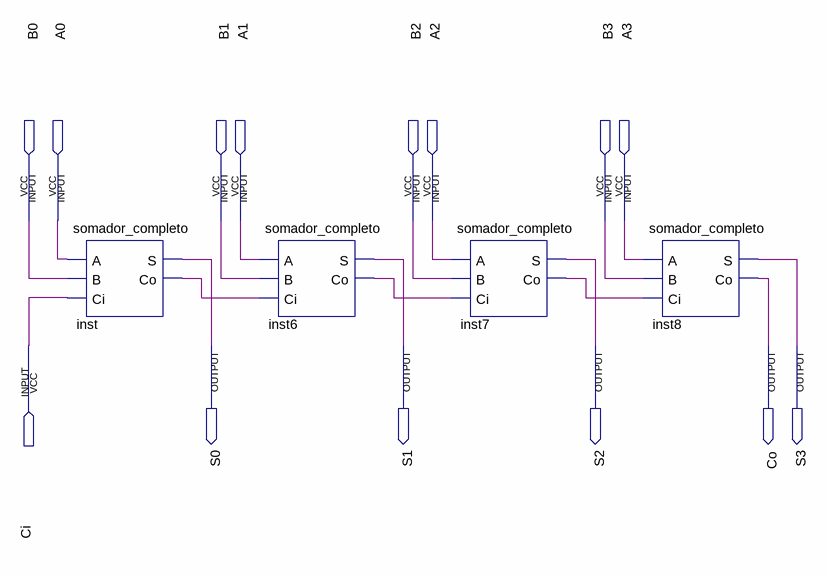
[diagram p0: schematic sheet]
// Quartus schematic somador_4bits.bdf as structural Verilog: 4 symbols, 14 pins
module somador_4bits (
  input  B0,
  input  A0,
  input  B1,
  input  A1,
  input  B2,
  input  A2,
  input  B3,
  input  A3,
  input  Ci,
  output S0,
  output S1,
  output S2,
  output Co,
  output S3
);

  wire inst6_co, inst7_co, inst_co;

  somador_completo inst (.A(A0), .B(B0), .Ci(Ci), .S(S0), .Co(inst_co));
  somador_completo inst6 (.A(A1), .B(B1), .Ci(inst_co), .S(S1), .Co(inst6_co));
  somador_completo inst7 (.A(A2), .B(B2), .Ci(inst6_co), .S(S2), .Co(inst7_co));
  somador_completo inst8 (.A(A3), .B(B3), .Ci(inst7_co), .S(S3), .Co(Co));
endmodule
